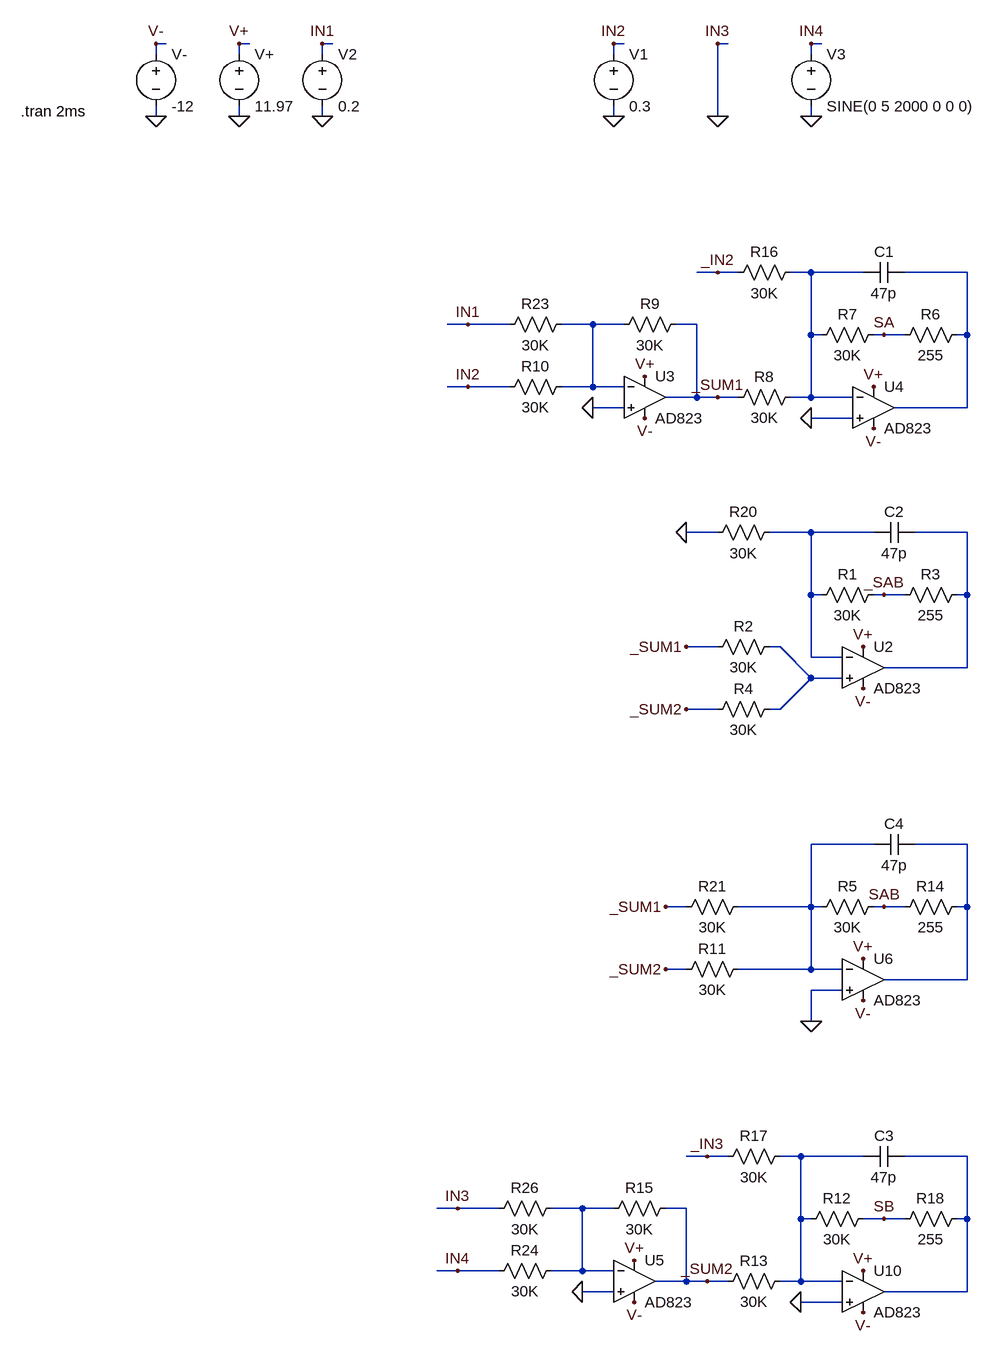
[diagram p0: schematic Mixer.asc]
Mixer.asc, the LTspice schematic file:
Version 4
SHEET 1 1408 972
WIRE -1504 -1440 -1520 -1440
WIRE -1376 -1440 -1392 -1440
WIRE -1248 -1440 -1264 -1440
WIRE -800 -1440 -816 -1440
WIRE -640 -1440 -656 -1440
WIRE -496 -1440 -512 -1440
WIRE -1520 -1424 -1520 -1440
WIRE -1392 -1424 -1392 -1440
WIRE -1264 -1424 -1264 -1440
WIRE -816 -1424 -816 -1440
WIRE -512 -1424 -512 -1440
WIRE -1520 -1328 -1520 -1344
WIRE -1392 -1328 -1392 -1344
WIRE -1264 -1328 -1264 -1344
WIRE -816 -1328 -816 -1344
WIRE -656 -1328 -656 -1440
WIRE -512 -1328 -512 -1344
WIRE -656 -1088 -688 -1088
WIRE -624 -1088 -656 -1088
WIRE -512 -1088 -544 -1088
WIRE -432 -1088 -512 -1088
WIRE -272 -1088 -368 -1088
WIRE -1040 -1008 -1072 -1008
WIRE -976 -1008 -1040 -1008
WIRE -848 -1008 -896 -1008
WIRE -800 -1008 -848 -1008
WIRE -688 -1008 -720 -1008
WIRE -512 -992 -512 -1088
WIRE -496 -992 -512 -992
WIRE -400 -992 -416 -992
WIRE -368 -992 -400 -992
WIRE -272 -992 -272 -1088
WIRE -272 -992 -288 -992
WIRE -1040 -912 -1072 -912
WIRE -976 -912 -1040 -912
WIRE -848 -912 -848 -1008
WIRE -848 -912 -896 -912
WIRE -800 -912 -848 -912
WIRE -688 -896 -688 -1008
WIRE -688 -896 -736 -896
WIRE -656 -896 -688 -896
WIRE -624 -896 -656 -896
WIRE -512 -896 -512 -992
WIRE -512 -896 -544 -896
WIRE -448 -896 -512 -896
WIRE -800 -880 -848 -880
WIRE -272 -880 -272 -992
WIRE -272 -880 -384 -880
WIRE -448 -864 -512 -864
WIRE -656 -688 -704 -688
WIRE -512 -688 -576 -688
WIRE -416 -688 -512 -688
WIRE -272 -688 -352 -688
WIRE -512 -592 -512 -688
WIRE -496 -592 -512 -592
WIRE -400 -592 -416 -592
WIRE -368 -592 -400 -592
WIRE -272 -592 -272 -688
WIRE -272 -592 -288 -592
WIRE -656 -512 -704 -512
WIRE -560 -512 -576 -512
WIRE -512 -496 -512 -592
WIRE -464 -496 -512 -496
WIRE -272 -480 -272 -592
WIRE -272 -480 -400 -480
WIRE -512 -464 -560 -512
WIRE -464 -464 -512 -464
WIRE -656 -416 -704 -416
WIRE -560 -416 -512 -464
WIRE -560 -416 -576 -416
WIRE -416 -208 -512 -208
WIRE -272 -208 -352 -208
WIRE -704 -112 -736 -112
WIRE -512 -112 -512 -208
WIRE -512 -112 -624 -112
WIRE -496 -112 -512 -112
WIRE -400 -112 -416 -112
WIRE -368 -112 -400 -112
WIRE -272 -112 -272 -208
WIRE -272 -112 -288 -112
WIRE -704 -16 -736 -16
WIRE -512 -16 -512 -112
WIRE -512 -16 -624 -16
WIRE -464 -16 -512 -16
WIRE -272 0 -272 -112
WIRE -272 0 -400 0
WIRE -464 16 -512 16
WIRE -512 64 -512 16
WIRE -672 272 -704 272
WIRE -640 272 -672 272
WIRE -528 272 -560 272
WIRE -432 272 -528 272
WIRE -272 272 -368 272
WIRE -1056 352 -1088 352
WIRE -992 352 -1056 352
WIRE -864 352 -912 352
WIRE -816 352 -864 352
WIRE -704 352 -736 352
WIRE -528 368 -528 272
WIRE -512 368 -528 368
WIRE -400 368 -432 368
WIRE -368 368 -400 368
WIRE -272 368 -272 272
WIRE -272 368 -288 368
WIRE -1056 448 -1088 448
WIRE -992 448 -1056 448
WIRE -864 448 -864 352
WIRE -864 448 -912 448
WIRE -816 448 -864 448
WIRE -704 464 -704 352
WIRE -704 464 -752 464
WIRE -672 464 -704 464
WIRE -640 464 -672 464
WIRE -528 464 -528 368
WIRE -528 464 -560 464
WIRE -464 464 -528 464
WIRE -816 480 -864 480
WIRE -272 480 -272 368
WIRE -272 480 -400 480
WIRE -464 496 -528 496
FLAG -1392 -1328 0
FLAG -1264 -1328 0
FLAG -1392 -1440 V+
FLAG -1520 -1328 0
FLAG -1520 -1440 V-
FLAG -400 -592 _SAB
FLAG -1040 -912 IN2
FLAG -416 -912 V+
FLAG -416 -848 V-
FLAG -768 -864 V-
FLAG -768 -928 V+
FLAG -400 -992 SA
FLAG -512 -864 0
FLAG -1264 -1440 IN1
FLAG -432 -512 V+
FLAG -432 -448 V-
FLAG -432 448 V+
FLAG -432 512 V-
FLAG -784 496 V-
FLAG -784 432 V+
FLAG -528 496 0
FLAG -400 368 SB
FLAG -432 -32 V+
FLAG -432 32 V-
FLAG -512 64 0
FLAG -400 -112 SAB
FLAG -656 -896 _SUM1
FLAG -672 464 _SUM2
FLAG -736 -112 _SUM1
FLAG -736 -16 _SUM2
FLAG -816 -1328 0
FLAG -816 -1440 IN2
FLAG -1040 -1008 IN1
FLAG -1056 448 IN4
FLAG -1056 352 IN3
FLAG -512 -1328 0
FLAG -512 -1440 IN4
FLAG -848 -880 0
FLAG -864 480 0
FLAG -656 -1440 IN3
FLAG -656 -1328 0
FLAG -704 -688 0
FLAG -704 -512 _SUM1
FLAG -704 -416 _SUM2
FLAG -656 -1088 _IN2
FLAG -672 272 _IN3
SYMBOL voltage -1392 -1440 R0
SYMATTR InstName V+
SYMATTR Value 11.97
SYMBOL voltage -1264 -1440 R0
SYMATTR InstName V2
SYMATTR Value 0.2
SYMBOL voltage -1520 -1440 R0
SYMATTR InstName V-
SYMATTR Value -12
SYMBOL Res -672 -496 R270
WINDOW 0 32 56 VTop 2
WINDOW 3 0 56 VBottom 2
SYMATTR InstName R2
SYMATTR Value 30K
SYMBOL Res -272 -608 R90
WINDOW 0 0 56 VBottom 2
WINDOW 3 32 56 VTop 2
SYMATTR InstName R3
SYMATTR Value 255
SYMBOL OpAmps/AD823 -768 -960 R0
SYMATTR InstName U3
SYMBOL OpAmps/AD823 -416 -944 R0
SYMATTR InstName U4
SYMBOL Res -272 -1008 R90
WINDOW 0 0 56 VBottom 2
WINDOW 3 32 56 VTop 2
SYMATTR InstName R6
SYMATTR Value 255
SYMBOL Res -400 -1008 R90
WINDOW 0 0 56 VBottom 2
WINDOW 3 32 56 VTop 2
SYMATTR InstName R7
SYMATTR Value 30K
SYMBOL Res -528 -912 R90
WINDOW 0 0 56 VBottom 2
WINDOW 3 32 56 VTop 2
SYMATTR InstName R8
SYMATTR Value 30K
SYMBOL Res -704 -1024 R90
WINDOW 0 0 56 VBottom 2
WINDOW 3 32 56 VTop 2
SYMATTR InstName R9
SYMATTR Value 30K
SYMBOL Res -880 -928 R90
WINDOW 0 0 56 VBottom 2
WINDOW 3 32 56 VTop 2
SYMATTR InstName R10
SYMATTR Value 30K
SYMBOL Cap -368 -1104 R90
WINDOW 0 0 32 VBottom 2
WINDOW 3 32 32 VTop 2
SYMATTR InstName C1
SYMATTR Value 47p
SYMBOL OpAmps/AD823 -432 -544 R0
SYMATTR InstName U2
SYMBOL Res -400 -608 R90
WINDOW 0 0 56 VBottom 2
WINDOW 3 32 56 VTop 2
SYMATTR InstName R1
SYMATTR Value 30K
SYMBOL Cap -352 -704 R90
WINDOW 0 0 32 VBottom 2
WINDOW 3 32 32 VTop 2
SYMATTR InstName C2
SYMATTR Value 47p
SYMBOL OpAmps/AD823 -784 400 R0
SYMATTR InstName U5
SYMBOL OpAmps/AD823 -432 416 R0
SYMATTR InstName U10
SYMBOL Res -416 352 R90
WINDOW 0 0 56 VBottom 2
WINDOW 3 32 56 VTop 2
SYMATTR InstName R12
SYMATTR Value 30K
SYMBOL Res -544 448 R90
WINDOW 0 0 56 VBottom 2
WINDOW 3 32 56 VTop 2
SYMATTR InstName R13
SYMATTR Value 30K
SYMBOL Res -720 336 R90
WINDOW 0 0 56 VBottom 2
WINDOW 3 32 56 VTop 2
SYMATTR InstName R15
SYMATTR Value 30K
SYMBOL Cap -368 256 R90
WINDOW 0 0 32 VBottom 2
WINDOW 3 32 32 VTop 2
SYMATTR InstName C3
SYMATTR Value 47p
SYMBOL Res -272 352 R90
WINDOW 0 0 56 VBottom 2
WINDOW 3 32 56 VTop 2
SYMATTR InstName R18
SYMATTR Value 255
SYMBOL OpAmps/AD823 -432 -64 R0
SYMATTR InstName U6
SYMBOL Res -400 -128 R90
WINDOW 0 0 56 VBottom 2
WINDOW 3 32 56 VTop 2
SYMATTR InstName R5
SYMATTR Value 30K
SYMBOL Res -608 -32 R90
WINDOW 0 0 56 VBottom 2
WINDOW 3 32 56 VTop 2
SYMATTR InstName R11
SYMATTR Value 30K
SYMBOL Cap -352 -224 R90
WINDOW 0 0 32 VBottom 2
WINDOW 3 32 32 VTop 2
SYMATTR InstName C4
SYMATTR Value 47p
SYMBOL Res -272 -128 R90
WINDOW 0 0 56 VBottom 2
WINDOW 3 32 56 VTop 2
SYMATTR InstName R14
SYMATTR Value 255
SYMBOL Res -608 -128 R90
WINDOW 0 0 56 VBottom 2
WINDOW 3 32 56 VTop 2
SYMATTR InstName R21
SYMATTR Value 30K
SYMBOL voltage -816 -1440 R0
SYMATTR InstName V1
SYMATTR Value 0.3
SYMBOL Res -880 -1024 R90
WINDOW 0 0 56 VBottom 2
WINDOW 3 32 56 VTop 2
SYMATTR InstName R23
SYMATTR Value 30K
SYMBOL Res -896 432 R90
WINDOW 0 0 56 VBottom 2
WINDOW 3 32 56 VTop 2
SYMATTR InstName R24
SYMATTR Value 30K
SYMBOL Res -896 336 R90
WINDOW 0 0 56 VBottom 2
WINDOW 3 32 56 VTop 2
SYMATTR InstName R26
SYMATTR Value 30K
SYMBOL voltage -512 -1440 R0
SYMATTR InstName V3
SYMATTR Value SINE(0 5 2000 0 0 0)
SYMBOL Res -560 -432 R90
WINDOW 0 0 56 VBottom 2
WINDOW 3 32 56 VTop 2
SYMATTR InstName R4
SYMATTR Value 30K
SYMBOL Res -560 -704 R90
WINDOW 0 0 56 VBottom 2
WINDOW 3 32 56 VTop 2
SYMATTR InstName R20
SYMATTR Value 30K
SYMBOL Res -528 -1104 R90
WINDOW 0 0 56 VBottom 2
WINDOW 3 32 56 VTop 2
SYMATTR InstName R16
SYMATTR Value 30K
SYMBOL Res -544 256 R90
WINDOW 0 0 56 VBottom 2
WINDOW 3 32 56 VTop 2
SYMATTR InstName R17
SYMATTR Value 30K
TEXT -1728 -1336 Left 2 !.tran 2ms

The netlist it stands for:
* Mixer.asc
V+ V+ 0 11.97
V2 IN1 0 0.2
V- V- 0 -12
R2 _SUM1 N006 30K
R3 N005 _SAB 255
XU3 0 N003 V+ V- _SUM1 AD823  ; pins In+ In- V+ V- OUT
XU4 0 N001 V+ V- N002 AD823  ; pins In+ In- V+ V- OUT
R6 N002 SA 255
R7 SA N001 30K
R8 N001 _SUM1 30K
R9 _SUM1 N003 30K
R10 N003 IN2 30K
C1 N002 N001 47p
XU2 N006 N004 V+ V- N005 AD823  ; pins In+ In- V+ V- OUT
R1 _SAB N004 30K
C2 N005 N004 47p
XU5 0 N011 V+ V- _SUM2 AD823  ; pins In+ In- V+ V- OUT
XU10 0 N009 V+ V- N010 AD823  ; pins In+ In- V+ V- OUT
R12 SB N009 30K
R13 N009 _SUM2 30K
R15 _SUM2 N011 30K
C3 N010 N009 47p
R18 N010 SB 255
XU6 0 N007 V+ V- N008 AD823  ; pins In+ In- V+ V- OUT
R5 SAB N007 30K
R11 N007 _SUM2 30K
C4 N008 N007 47p
R14 N008 SAB 255
R21 N007 _SUM1 30K
V1 IN2 0 0.3
R23 N003 IN1 30K
R24 N011 IN4 30K
R26 N011 0 30K
V3 IN4 0 SINE(0 5 2000 0 0 0)
R4 N006 _SUM2 30K
R20 N004 0 30K
R16 N001 _IN2 30K
R17 N009 _IN3 30K
.tran 2ms
.lib ADI.lib
.backanno
.end